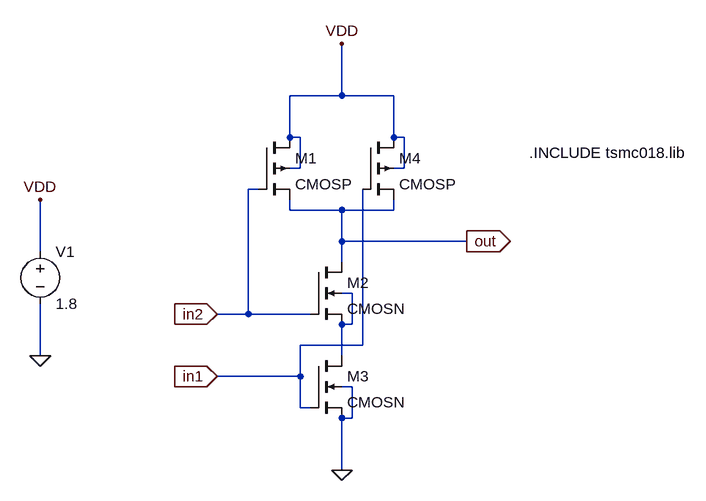
[diagram p0: schematic nand2.asc]
nand2.asc, the LTspice schematic file:
Version 4
SHEET 1 880 680
WIRE 336 80 336 0
WIRE 336 80 256 80
WIRE 416 80 336 80
WIRE 256 144 256 80
WIRE 272 144 256 144
WIRE 416 144 416 80
WIRE 432 144 416 144
WIRE 272 192 272 144
WIRE 272 192 256 192
WIRE 432 192 432 144
WIRE 432 192 416 192
WIRE 208 224 192 224
WIRE 256 256 256 240
WIRE 336 256 256 256
WIRE 416 256 416 240
WIRE 416 256 336 256
WIRE 336 304 336 256
WIRE 528 304 336 304
WIRE -128 320 -128 240
WIRE 336 336 336 304
WIRE 352 384 336 384
WIRE 192 416 192 224
WIRE 192 416 144 416
WIRE 288 416 192 416
WIRE 352 432 352 384
WIRE 352 432 336 432
WIRE 368 464 368 224
WIRE 368 464 272 464
WIRE -128 480 -128 400
WIRE 336 480 336 432
WIRE 272 512 272 464
WIRE 272 512 144 512
WIRE 352 528 336 528
WIRE 272 560 272 512
WIRE 288 560 272 560
WIRE 352 576 352 528
WIRE 352 576 336 576
WIRE 336 656 336 576
FLAG 336 0 VDD
FLAG 144 416 in2
IOPIN 144 416 In
FLAG 528 304 out
IOPIN 528 304 Out
FLAG -128 480 0
FLAG -128 240 VDD
FLAG 144 512 in1
IOPIN 144 512 In
FLAG 336 656 0
SYMBOL cmosp 208 144 R0
SYMATTR InstName M1
SYMATTR Value2 l=180n w=360n
SYMBOL cmosn 288 336 R0
SYMATTR InstName M2
SYMATTR Value2 l=180n w=180n
SYMBOL voltage -128 304 R0
WINDOW 123 0 0 Left 0
WINDOW 39 0 0 Left 0
SYMATTR InstName V1
SYMATTR Value 1.8
SYMBOL cmosn 288 480 R0
SYMATTR InstName M3
SYMATTR Value2 l=180n w=360n
SYMBOL cmosp 368 144 R0
SYMATTR InstName M4
SYMATTR Value2 l=180n w=360n
TEXT 624 168 Left 2 !.INCLUDE tsmc018.lib

The netlist it stands for:
* nand2.asc
M1 VDD in2 out VDD CMOSP l=180n w=360n
M2 out in2 N001 N001 CMOSN l=180n w=180n
V1 VDD 0 1.8
M3 N001 in1 0 0 CMOSN l=180n w=360n
M4 VDD in1 out VDD CMOSP l=180n w=360n
.model NMOS NMOS
.model PMOS PMOS
.lib standard.mos
.INCLUDE tsmc018.lib
.backanno
.end